# EAGLE design multi_sensor_board_TSL230RD_TCS3200RD (EAGLE 6.5.0)
REV: 1.0
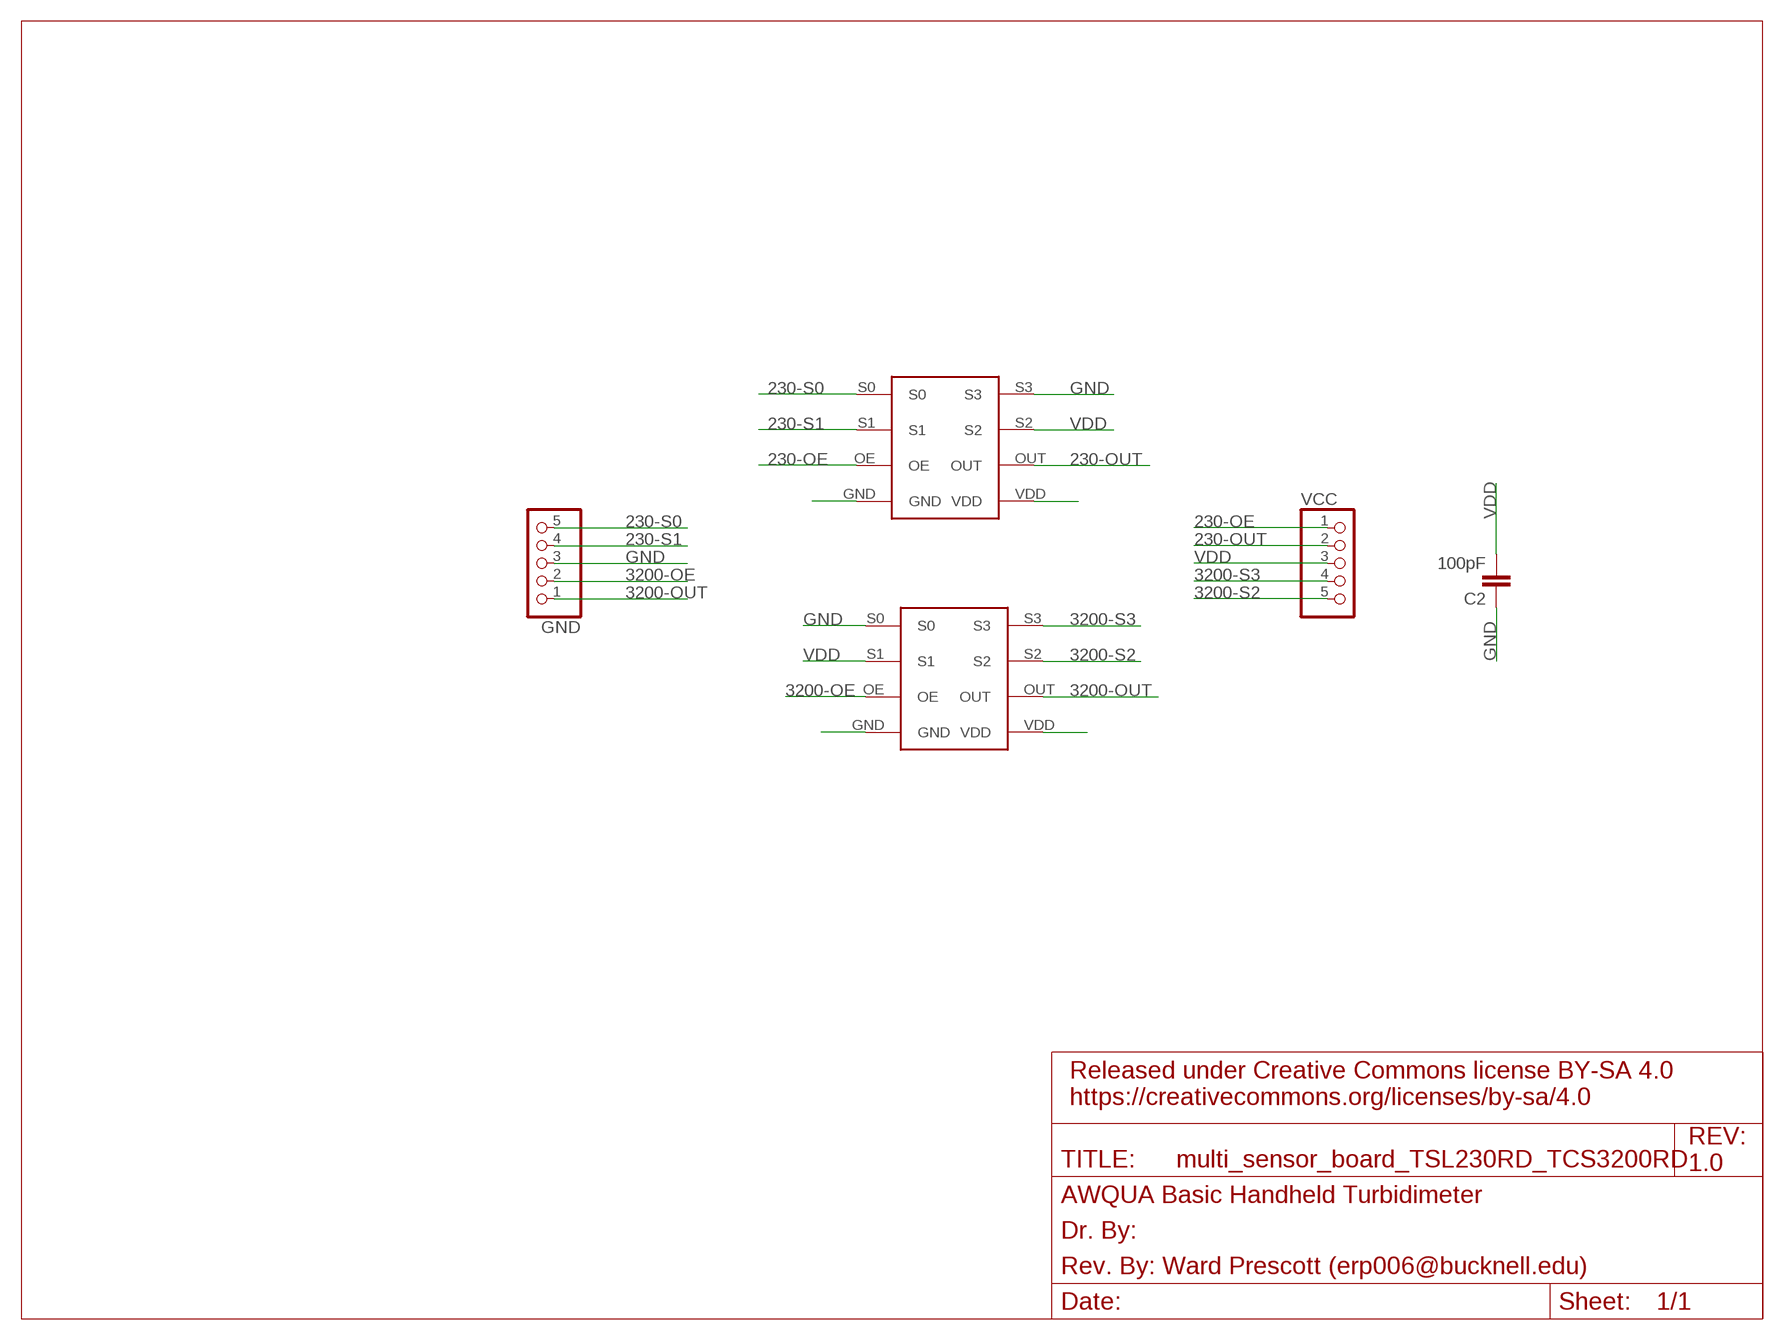
[diagram p0: schematic, sheet 1]

## Parts
C2  100pF  1.0UF-25V-+80/-20(0805)  [0805]
COLOR  TCS3200RD  TSL230RDSMD  [TSL230RD]
GND  PINHD-1X5  [1X05]
IR  TSL230R  TSL230RDSMD  [TSL230RD]
VCC  PINHD-1X5  [1X05]

## Nets
230-OE: IR.OE VCC.1
230-OUT: IR.OUT VCC.2
230-S0: GND.5 IR.S0
230-S1: GND.4 IR.S1
3200-OE: COLOR.OE GND.2
3200-OUT: COLOR.OUT GND.1
3200-S2: COLOR.S2 VCC.5
3200-S3: COLOR.S3 VCC.4
GND: C2.1 COLOR.GND COLOR.S0 GND.3 IR.GND IR.S3
VDD: C2.2 COLOR.S1 COLOR.VDD IR.S2 IR.VDD VCC.3

## Notes on the sheet
- Released under Creative Commons license BY-SA 4.0 
  https://creativecommons.org/licenses/by-sa/4.0

## Library data of the parts
C2 = SparkFun-Capacitors:1.0UF-25V-+80/-20(0805): CAP-11625; PROD_ID: CAP-11625; VALUE: 1.0uF
COLOR IR = open_source_turbidimeter:TSL230RD
GND VCC = pinhead:PINHD-1X5: PIN HEADER

## Board
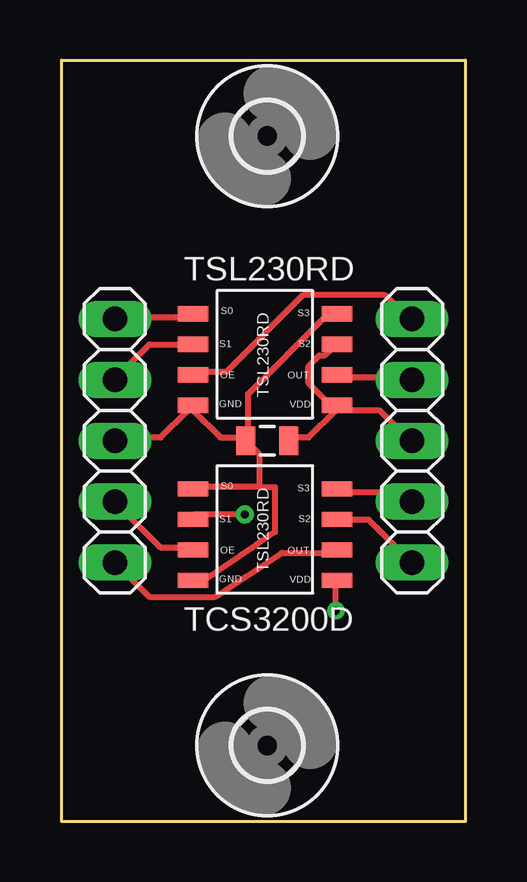
[diagram p1: board, top side]
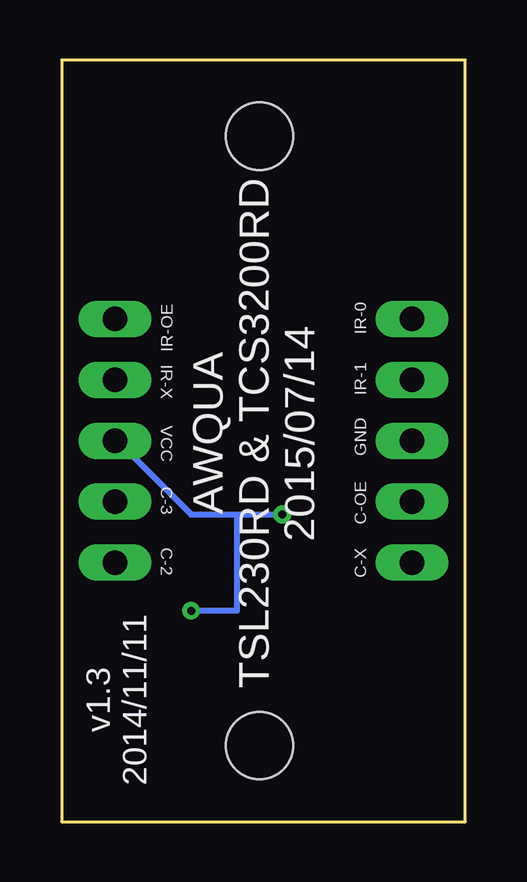
[diagram p2: board, bottom side, seen from below]

Size 16.83 x 31.75 mm. Coordinates in mm from the lower left corner, seen from the top.
Outline: 0,0 0,31.75 16.83,31.75 16.83,0 0,0
Copper layers (1*16): Top 0.035mm / dielectric 1.5mm / Bottom 0.035mm
Design rules "default *": minimum track width 10mil, minimum drill 12mil, track to track 8mil, track to pad 8mil, pad to pad 8mil, via to via 8mil, smd to smd 8mil, copper to edge 40mil, drill to drill 8mil, minimum pad ring 10mil, minimum via ring 8mil, stop-mask expansion 4mil, vias tented up to drill 13mil, thermal gap 10mil

### Footprints (pad centres in the part's own frame; a part is rotated, then mirrored left to right if it is on the bottom)
0805 = smd 0.8 x 1.2: 1 -0.9,0; 2 0.9,0
TSL230RD = smd 0.635 x 1.27: GND 0.53,5; OE 1.8,5; OUT 1.8,-1; S0 4.34,5; S1 3.07,5; S2 3.07,-1; S3 4.34,-1; VDD 0.53,-1
1X05 = drill 1.016 long: 1 -5.08,0; 2 -2.54,0; 3 0,0; 4 2.54,0; 5 5.08,0
2,8 = hole 2.8: 0,0

### Placement (x,y rotation side)
C2  8.57,15.88 0 top
COLOR  10.48,9.53 90 top
GND  2.22,15.88 90 top
IR  10.48,16.83 90 top
U$1  [2,8]  8.57,28.57 0 top
U$2  [2,8]  8.57,3.17 0 top
VCC  14.61,15.88 270 top

### Tracks (layer width: path | path; a pad name or v marks a point on that pad's centre or on a via)
230-OE
  Top 0.254: IR.OE 5.49,18.75 6.86,18.75 10.06,21.95 13.49,21.95 14.4,21.03 VCC.1
230-OUT
  Top 0.254: IR.OUT 11.66,18.52 14.4,18.52 VCC.2
230-S0
  Top 0.254: IR.S0 5.26,21.03 2.29,21.03 GND.5
230-S1
  Top 0.254: IR.S1 5.26,19.89 3.66,19.89 2.29,18.52 GND.4
3200-OE
  Top 0.254: COLOR.OE 5.26,11.43 4.12,11.43 2.29,13.26 GND.2
3200-OUT
  Top 0.254: COLOR.OUT 11.43,11.2 9.18,11.2 6.4,9.37 3.66,9.37 2.29,10.74 GND.1
3200-S2
  Top 0.254: COLOR.S2 11.66,12.57 12.8,12.57 14.4,10.97 VCC.5
3200-S3
  Top 0.254: COLOR.S3 11.66,13.72 14.17,13.72 14.4,13.49 VCC.4
GND
  Top 0.254: C2.1 7.54,16 6.63,16 5.49,17.14 IR.GND 5.26,17.14 4.12,16 2.29,16 GND.3 | 8.23,13.95 8.23,15.32 7.77,15.77 C2.1 | 8.23,13.95 8.89,13.95 8.89,12.06 7.91,11.39 5.94,10.06 COLOR.GND | 8.23,13.95 5.49,13.95 COLOR.S0 | IR.S3 11.43,21.03 10.97,21.03 7.77,17.83 7.77,16 C2.1
VDD  (via drill 0.33)
  Top 0.254: 11.43,17.14 10.29,16 9.6,16 C2.2 | 11.43,17.14 10.29,18.29 10.29,18.97 10.74,19.43 10.97,19.43 11.43,19.89 IR.S2 | 11.43,17.14 IR.VDD 11.66,17.14 13.26,17.14 14.4,16 VCC.3 | v7.63,12.8 5.49,12.8 COLOR.S1 | v11.43,8.79 11.43,10.06 COLOR.VDD
  Bottom 0.254: 9.53,12.8 11.43,12.8 14.4,15.77 VCC.3 | 9.53,12.8 v7.63,12.8 | 9.53,12.8 9.53,8.79 v11.43,8.79

### Text on the board
tNames: TSL230RD | TCS3200D
bNames: IR-OE | IR-0 | IR-X | IR-1 | VCC | AWQUA / TSL230RD & TCS3200RD / 2015/07/14 | GND | C-3 | C-OE | C-2 | C-X | v1.3 / 2014/11/11
Document: Released under Creative Commons license BY-SA 4.0 / https://creativecommons.org/licenses/by-sa/4.0